# EAGLE design BPW5020-Audio-Wing (EAGLE 6.3)
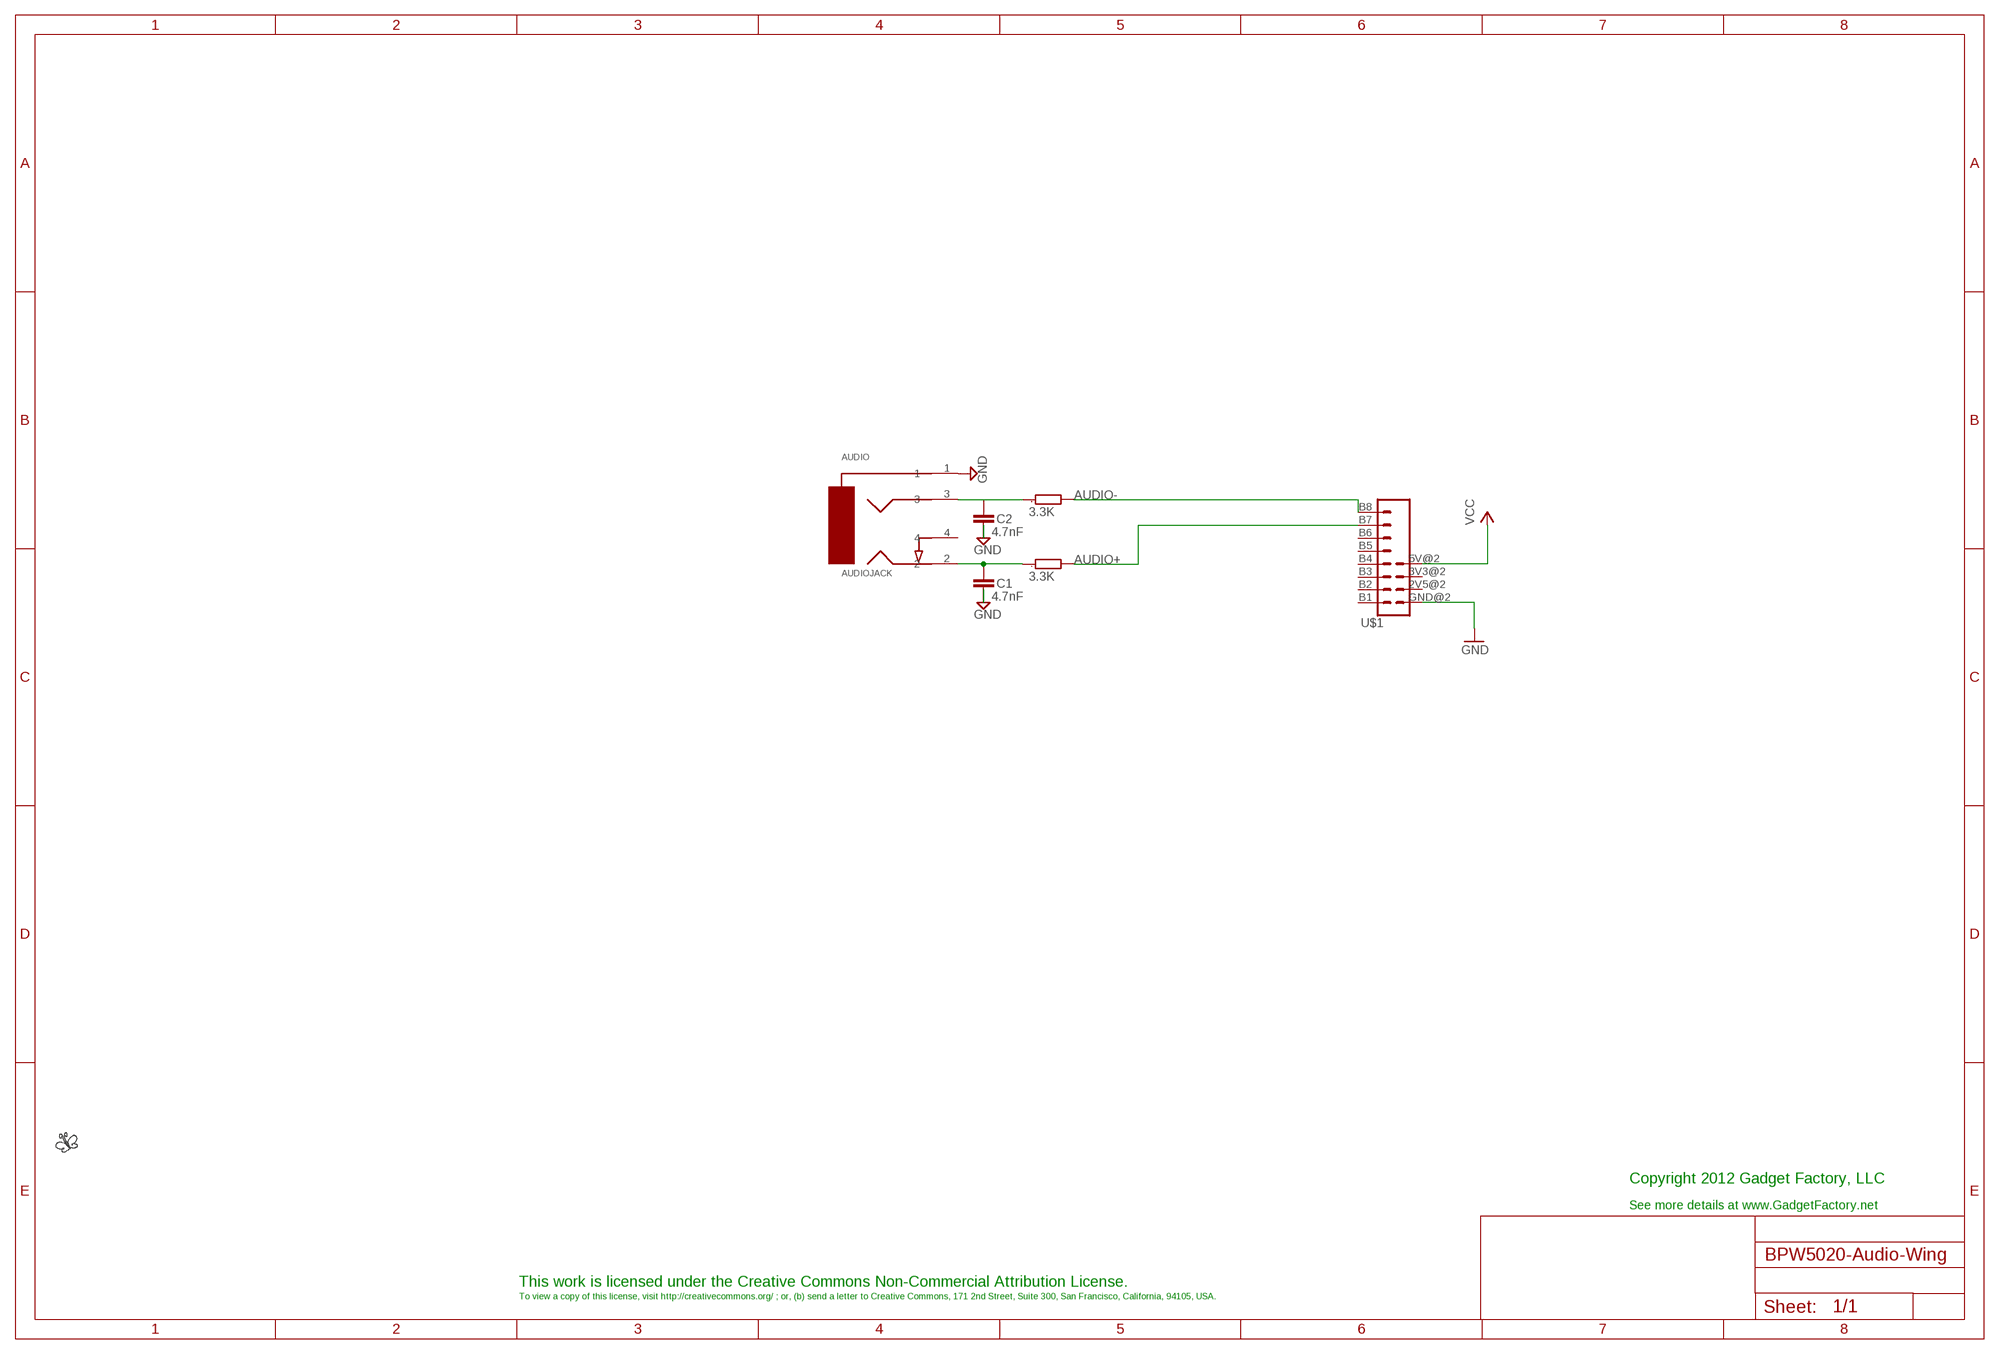
[diagram p0: schematic, sheet 1]

## Parts
AUDIO  AUDIOJACK  [AUDJCK]
C1  4.7nF  C-EU050-025X075  [C050-025X075]
C2  4.7nF  C-EU050-025X075  [C050-025X075]
LOGO1  BUTTERFLY_LOGO  [BUTTERFLY_LOGO]
R1  3.3K  R  [DUALRESISTOR]
R2  3.3K  R  [DUALRESISTOR]
U$1  WING_8BIT  [WINGSIDE_8BIT]

## Nets
AUDIO+: R1.2 U$1.B7
AUDIO-: R2.2 U$1.B8
GND: AUDIO.1 C1.2 C2.2 U$1.GND@2(GND)
N$1: AUDIO.3 C2.1 R2.1
N$5: AUDIO.2 C1.1 R1.1
VCC: U$1.5V@2(5V)
Unconnected: AUDIO.4 U$1.2V5@2(2V5) U$1.3V3@2(3V3) U$1.B1 U$1.B2 U$1.B3 U$1.B4 U$1.B5 U$1.B6

## Notes on the sheet
- Copyright 2012 Gadget Factory, LLC
- See more details at www.GadgetFactory.net
- This work is licensed under the Creative Commons Non-Commercial Attribution License.
- To view a copy of this license, visit http://creativecommons.org/ ; or, (b) send a letter to Creative Commons, 171 2nd Street, Suite 300, San Francisco, California, 94105, USA.

## Library data of the parts
AUDIO = GadgetFactory:AUDIOJACK
C1 C2 = resistor:C-EU: CAPACITOR, European symbol
LOGO1 = GadgetFactory_Pub:BUTTERFLY_LOGO
R1 R2 = GadgetFactory:R: RESISTOR, European symbol
U$1 = GadgetFactory_Pub:WING_8BIT

## Board
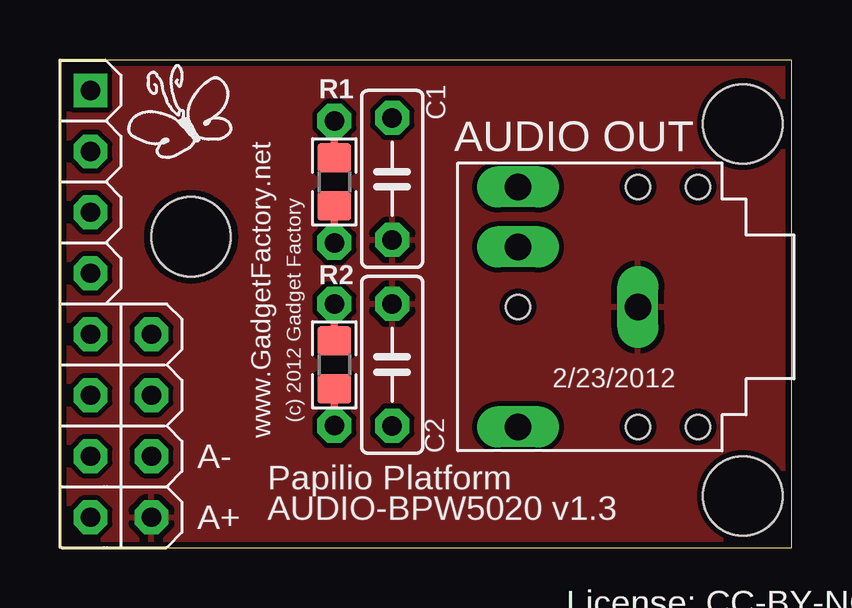
[diagram p1: board, top side]
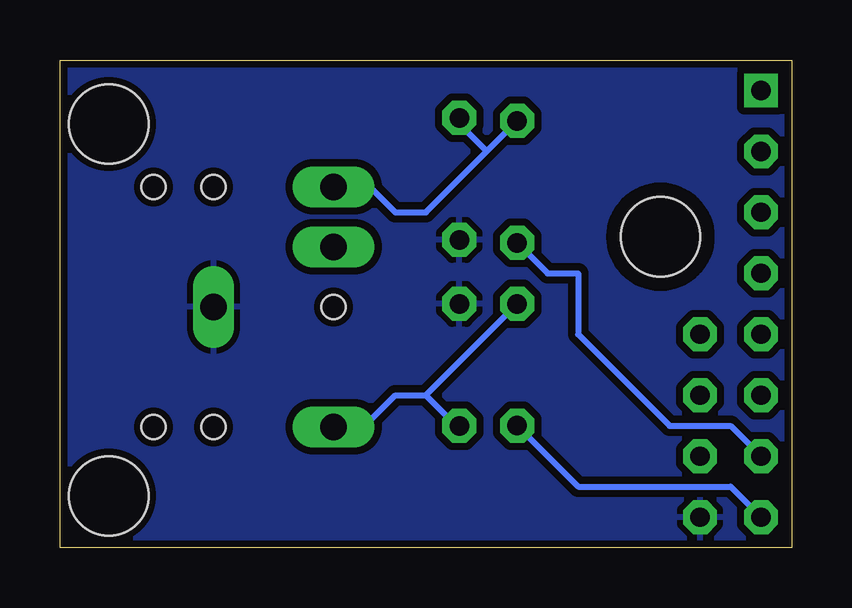
[diagram p2: board, bottom side, seen from below]

Size 30.48 x 20.32 mm. Coordinates in mm from the lower left corner, seen from the top.
Outline: 0,0 30.48,0 30.48,20.32 0,20.31 0,0
Copper layers (1*16): Top 0.035mm / dielectric 1.5mm / Bottom 0.035mm
Design rules "SparkFun_Derived_GoldePheonix_10mil": minimum track width 10mil, minimum drill 15mil, track to track 8mil, track to pad 8mil, pad to pad 8mil, via to via 8mil, smd to smd 8mil, copper to edge 10mil, drill to drill 8mil, minimum pad ring 12mil, minimum via ring 10mil, stop-mask expansion 4mil, vias tented up to drill 18mil, thermal gap 10mil
Holes 3.3 mm at 28.45,2.16 28.45,17.65

### Footprints (pad centres in the part's own frame; a part is rotated, then mirrored left to right if it is on the bottom)
AUDJCK = drill 1.1 long: 1 -5,0; 2 -10,5; 3 -10,-5; 4 -10,2.5 | hole 1: -5,5; -5,-5; -2.5,5; -2.5,-5; -10,0
C050-025X075 = drill 0.813 octagon: 1 -2.54,0; 2 2.54,0
DUALRESISTOR = drill 0.813 octagon: 1 -2.543,0; 2 2.537,0 | smd 1.2 x 1.4: 3 -1,0; 4 1,0
WINGSIDE_8BIT = drill 0.8 octagon: 2V5@2 16.51,3.81; 3V3@2 13.97,3.81; 5V@2 11.43,3.81; B2 3.81,1.27; B3 6.35,1.27; B4 8.89,1.27; B5 11.43,1.27; B6 13.97,1.27; B7 16.51,1.27; B8 19.05,1.27; GND@2 19.05,3.81 | drill 0.8 square: B1 1.27,1.27 | hole 3.302: 7.366,5.461

### Placement (x,y rotation side)
AUDIO  29.08,10.03 0 top
C1  13.84,15.37 270 top
C2  13.84,7.62 90 top
LOGO1  5.08,17.65 0 top
R1  11.43,15.24 270 top
R2  11.43,7.62 270 top
U$1  0,20.32 270 top

### Tracks (layer width: path | path; a pad name or v marks a point on that pad's centre or on a via)
AUDIO+
  Bottom 0.254: U$1.B7 2.54,5.08 5.08,5.08 8.89,8.89 8.89,11.43 10.16,11.43 R1.2
AUDIO-
  Bottom 0.254: U$1.B8 2.54,2.54 8.89,2.54 R2.2
GND
  pour Bottom (isolate 0.305): 0,20.32 30.48,20.32 30.48,0 0,0
  pour Top: 0,20.32 30.48,20.32 30.48,0 0,0
N$1
  Bottom 0.254: 15.24,6.35 R2.1 | 15.24,6.35 16.51,6.35 17.78,5.08 19.05,5.08 AUDIO.3 | 15.24,6.35 13.97,5.08 C2.1
N$5
  Bottom 0.254: 12.7,16.51 15.24,13.97 16.51,13.97 17.78,15.24 19.05,15.24 AUDIO.2 | 12.7,16.51 R1.1 | 12.7,16.51 13.97,17.78 C1.1

### Text on the board
tPlace: AUDIO OUT | 2/23/2012 | www.GadgetFactory.net | (c) 2012 Gadget Factory | A- | Papilio Platform | A+ | AUDIO-BPW5020 v1.3 | License: CC-BY-NC